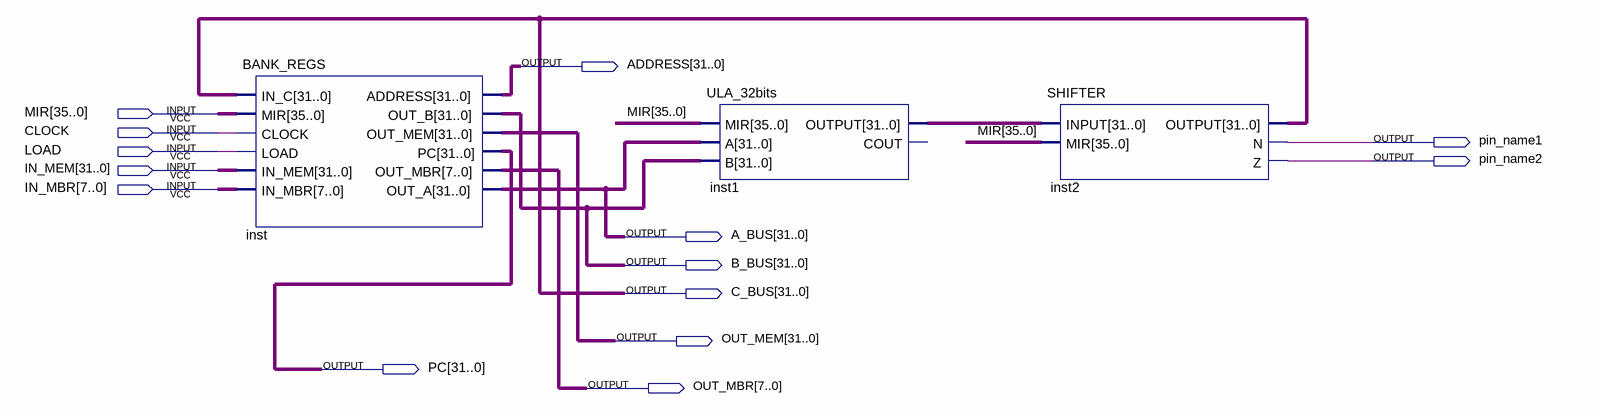
[diagram p0: schematic sheet]
// Quartus schematic DATAPATH.bdf as structural Verilog: 3 symbols, 14 pins
module DATAPATH (
  input  [35:0] MIR,
  input  CLOCK,
  input  LOAD,
  input  [31:0] IN_MEM,
  input  [7:0] IN_MBR,
  output [31:0] ADDRESS,
  output pin_name1,
  output pin_name2,
  output [31:0] A_BUS,
  output [31:0] B_BUS,
  output [31:0] C_BUS,
  output [31:0] OUT_MEM,
  output [31:0] PC,
  output [7:0] OUT_MBR
);

  wire [31:0] inst1_output;

  BANK_REGS inst (
    .IN_C(C_BUS), .MIR(MIR), .CLOCK(CLOCK), .LOAD(LOAD), .IN_MEM(IN_MEM), .IN_MBR(IN_MBR), .ADDRESS(ADDRESS),
    .OUT_B(B_BUS), .OUT_MEM(OUT_MEM), .PC(PC), .OUT_MBR(OUT_MBR), .OUT_A(A_BUS));
  ULA_32bits inst1 (.MIR(MIR), .A(A_BUS), .B(B_BUS), .OUTPUT(inst1_output));  // open: COUT
  SHIFTER inst2 (.INPUT(inst1_output), .MIR(MIR), .OUTPUT(C_BUS), .N(pin_name1), .Z(pin_name2));
endmodule
